# Altium schematic sheet AA8513.SCHDOC
size B
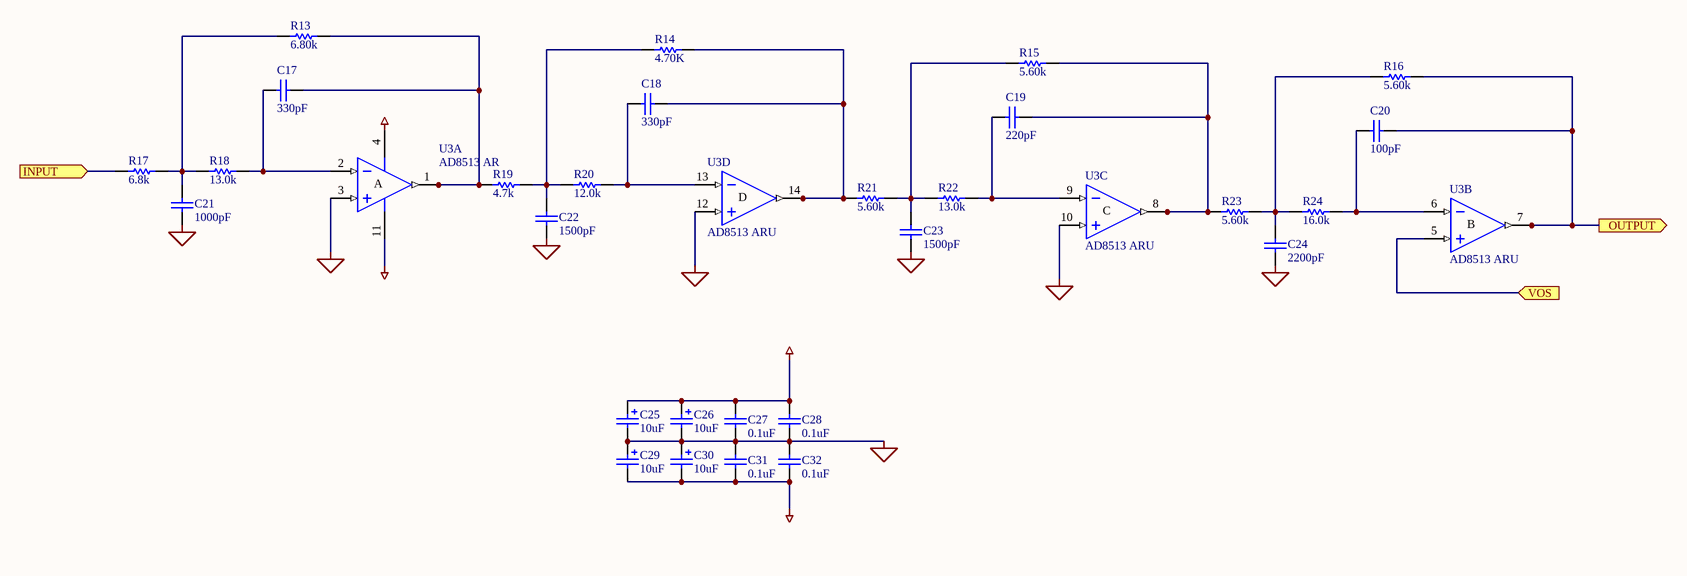
[diagram p0: AA8513.SCHDOC]

## Parts
C17  value 330pF  [CC1608-0603]  (hidden comment: Cap)
C18  value 330pF  [CC1608-0603]  (hidden comment: Cap)
C19  value 220pF  [CC1608-0603]  (hidden comment: Cap)
C20  value 100pF  [CC1608-0603]  (hidden comment: Cap)
C21  value 1000pF  [CC1608-0603]  (hidden comment: Cap)
C22  value 1500pF  [CC1608-0603]  (hidden comment: Cap)
C23  value 1500pF  [CC1608-0603]  (hidden comment: Cap)
C24  value 2200pF  [CC1608-0603]  (hidden comment: Cap)
C25  value 10uF  [TC3528-1411]  (hidden comment: Cap Pol1)
C26  value 10uF  [TC3528-1411]  (hidden comment: Cap Pol1)
C27  value 0.1uF  [CC1608-0603]  (hidden comment: Cap)
C28  value 0.1uF  [CC1608-0603]  (hidden comment: Cap)
C29  value 10uF  [TC3528-1411]  (hidden comment: Cap Pol1)
C30  value 10uF  [TC3528-1411]  (hidden comment: Cap Pol1)
C31  value 0.1uF  [CC1608-0603]  (hidden comment: Cap)
C32  value 0.1uF  [CC1608-0603]  (hidden comment: Cap)
R13  value 6.80k  [CC1608-0603]  (hidden comment: Res1)
R14  value 4.70K  [CC1608-0603]  (hidden comment: Res1)
R15  value 5.60k  [CC1608-0603]  (hidden comment: Res1)
R16  value 5.60k  [CC1608-0603]  (hidden comment: Res1)
R17  value 6.8k  [CC1608-0603]  (hidden comment: Res1)
R18  value 13.0k  [CC1608-0603]  (hidden comment: Res1)
R19  value 4.7k  [CC1608-0603]  (hidden comment: Res1)
R20  value 12.0k  [CC1608-0603]  (hidden comment: Res1)
R21  value 5.60k  [CC1608-0603]  (hidden comment: Res1)
R22  value 13.0k  [CC1608-0603]  (hidden comment: Res1)
R23  value 5.60k  [CC1608-0603]  (hidden comment: Res1)
R24  value 16.0k  [CC1608-0603]  (hidden comment: Res1)
U3  AD8513 AR  [SO-G14]  (parts A,B,C,D of 4)

## Ports
INPUT (in), OUTPUT (out), VOS (in)

## Nets
AGND: C21.1 C22.1 C23.1 C24.1 C25.2 C26.2 C27.1 C28.1 C29.1 C30.1 C31.2 C32.2 U3.3(IN+A) U3.10(IN+C) U3.12(IN+D)
AVDD: C25.1 C26.1 C27.2 C28.2 U3.4(V+)
AVSS: C29.2 C30.2 C31.1 C32.1 U3.11(V-)
INPUT: R17.1 ; port INPUT
OUTPUT: C20.1 R16.1 U3.7(OUTB) ; port OUTPUT
VOS: U3.5(IN+B) ; port VOS
NetC17_1: C17.1 R13.1 R19.1 U3.1(OUTA)
NetC17_2: C17.2 R18.2 U3.2(IN-A)
NetC18_1: C18.1 R14.1 R21.1 U3.14(OUTD)
NetC18_2: C18.2 R20.2 U3.13(IN-D)
NetC19_1: C19.1 R15.1 R23.1 U3.8(OUTC)
NetC19_2: C19.2 R22.2 U3.9(IN-C)
NetC20_2: C20.2 R24.2 U3.6(IN-B)
NetC21_2: C21.2 R13.2 R17.2 R18.1
NetC22_2: C22.2 R14.2 R19.2 R20.1
NetC23_2: C23.2 R15.2 R21.2 R22.1
NetC24_2: C24.2 R16.2 R23.2 R24.1

## Notes on the sheet
- (in symbol AD8513ARU, part A) A
- (in symbol AD8513ARU, part B) B
- (in symbol AD8513ARU, part C) C
- (in symbol AD8513ARU, part D) D

## Library data of the parts
C17-C24 C27 C28 C31 C32 = Cap: Capacitor; Manufacturer: Generic Components; Class I: Passive; Published: 8-Jun-2000; Revision: July-2002: Re-released for DXP Platform.; Publisher: Altium Limited; Class II: Capacitor
C25 C26 C29 C30 = Cap Pol1: Polarized Capacitor (Radial); Manufacturer: Generic Components; Class I: Passive; Published: 8-Jun-2000; Revision: July-2002: Re-released for DXP Platform.; Publisher: Altium Limited; Class II: Capacitor
R13-R24 = Res1: Resistor; Manufacturer: Generic Components; Class I: Passive; Published: 8-Jun-2000; Revision: July-2002: Re-released for DXP Platform.; Publisher: Altium Limited; Class II: Resistor
U3 = AD8513ARU: low-noise JFET quad OA